# Altium project Cyclomotion.PrjPcb
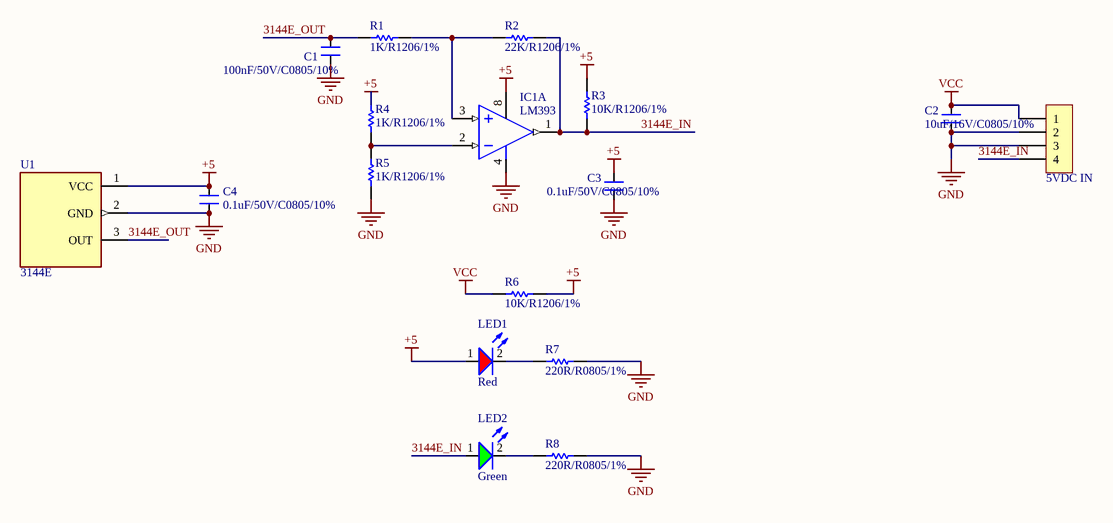
[diagram p0: Hall_module.SchDoc]
1 sheet, 17 parts. Net scope: global (net labels, ports and power ports of the same name join across sheets).
Board file: Hall_module.PcbDoc

## Sheet Hall_module.SchDoc
size A4; SheetNumber: 1; SheetTotal: 1

### Parts
C1  100nF/50V/C0805/10%  [CAP_CERA_C2012(CC0805INCH)]
C2  10uF/16V/C0805/10%  [CAP_CERA_C2012(CC0805INCH)]
C3  0.1uF/50V/C0805/10%  [CAP_CERA_C2012(CC0805INCH)]
C4  0.1uF/50V/C0805/10%  [CAP_CERA_C2012(CC0805INCH)]
H1  5VDC IN  [XH2.54M-4]
IC1  LM393  [U_LM393_DIP8_THT]  (part A of 2)
LED1  value Red  [Led 0805R]  (hidden comment: LED-0805RVC)
LED2  value Green  [Led 0805G]  (hidden comment: LED-0805GVC)
R1  1K/R1206/1%  [Res 1206 SMD]
R2  22K/R1206/1%  [Res 1206 SMD]
R3  10K/R1206/1%  [Res 1206 SMD]
R4  1K/R1206/1%  [Res 1206 SMD]
R5  1K/R1206/1%  [Res 1206 SMD]
R6  10K/R1206/1%  [Res 1206 SMD]
R7  220R/R0805/1%  [Res 0805 SMD]
R8  220R/R0805/1%  [Res 0805 SMD]
U1  3144E  [U_3144E]

### Nets
+5: C3.1 C4.1 IC1.8(+V) LED1.1(A) R3.1 R4.1 R6.2 U1.1(VCC)
GND: C1.1 C2.1 C3.2 C4.2 H1.2 H1.3 IC1.4(-V) R5.2 R7.2 R8.2 U1.2(GND)
VCC: C2.2 H1.1 R6.1
3144E_IN: H1.4 IC1.1(OUT) LED2.1(A) R2.2 R3.2
3144E_OUT: C1.2 R1.2 U1.3(OUT)
NetIC1_2: IC1.2(IN-) R4.2 R5.1
NetIC1_3: IC1.3(IN+) R1.1 R2.1
NetLED1_2: LED1.2(K) R7.1
NetLED2_2: LED2.2(K) R8.1

### Library data of the parts
C1-C4 = CAP CERA 0805: CERAMIC CAP 0805; Value: 100pF, 2012
H1 = Header 4P 2.54 Duc Thang: Cắm; Ten_Linh_Kien: Header 4P XH2.54-4P Đực Thẳng; Don_Vi: Con; Ma_Hang: MH001285; Chung_Loai: Cắm
IC1 = LM358: Low-Power Dual Operational Amplifier; Value: LM358
LED1 = LED-0805RVC: LED Red 2mA 1.8V 0805; ComponentLink1Description: Datasheet; ComponentLink1URL: D:\Dropbox\Datasheets\Opto and Illumination\LEDs\SMD LED.pdf; Unit Price: 0.0476
LED2 = LED-0805GVC: LED Green 2mA 3V 0805; ComponentLink1Description: Datasheet; ComponentLink1URL: D:\Dropbox\Datasheets\Opto and Illumination\LEDs\SMD LED.pdf; Unit Price: 0.0476
R1-R6 = RES-1206: RES SMD 10K OHM 1% 1206; Manufacturer: Yageo; Manufacturer Part Number: RC1206FR-075R1L; Resistance (Ohms): 5.1; Power (Watts): 0.25W, 1/4W; Temperature Coefficient: ±200ppm/°C; Supplier 1: Digi-Key; RoHS: RoHS Compliant; Category: Resistors; Stock 1: 96701; Pricing 1: 1=0.1, 10=0.051, 100=0.0207, 1000=0.0093, 2500=0.00807 (USD); Packaging: Cut Tape (CT); Part Status: Active; Tolerance: ±1%; Composition: Thick Film; Features: Moisture Resistant; Operating Temperature: -55°C ~ 155°C; Package / Case: 1206 (3216 Metric); Supplier Device Package: 1206; Size / Dimension: 0.122" L x 0.063" W (3.10mm x 1.60mm); Height - Seated (Max): 0.026" (0.65mm); Failure Rate: -; ComponentLink1URL: http://www.yageo.com/documents/recent/PYu-RC_Group_51_RoHS_L_7.pdf; ComponentLink1Description: http://www.yageo.com/documents/recent/PYu-RC_Group_51_RoHS_L_7.pdf; Supplier Part Number 1: 311-5.10FRCT-ND
R7 R8 = 34.8K/R0805/1%: Thick Film Resistors - SMD 34.8K OHM 1% 0805; Manufacturer: Yageo; Manufacturer Part Number: RC0603FR-0734K8L; Power Rating: 100mW; Resistance: 34.8kR; Voltage Rating: 50V; Temperature Coefficient: 100ppm/°C; Supplier 1: Digi-Key; Stock 1: 82861; Pricing 1: 1=0.1, 10=0.026, 100=0.0107, 1000=0.0048, 2500=0.0042 (USD); Case/Package: 0603; Case Code (Imperial): 0603; Case Code (Metric): 1608; Min Operating Temperature: -55°C; Max Operating Temperature: 155°C; Tolerance: 1%; Packaging: Tape and Reel; Termination: SMD/SMT; Composition: Thick Film; Military Standard: Not; Voltage Rating (DC): 50V; Length: 1.6mm; Height: 0.45mm; Width: 0.8mm; Depth: 0.8mm; Lead Free: Lead Free; Supplier Part Number 1: 311-34.8KHRCT-ND
U1 = SS541AT: Digital hall sensor switch Open Collector Hall Effect; MF: Honeywell Sensing; SnapEDA_Link: https://www.snapeda.com/parts/SS541AT/Honeywell+Sensing+and+Control/view-part/?ref=snap; Package: SOT-89 Honeywell; Value: *; MP: SS541AT; Check_prices: https://www.snapeda.com/parts/SS541AT/Honeywell+Sensing+and+Control/view-part/?ref=eda